# Altium schematic sheet MainBoard_RELAY.SchDoc
size 594 x 420 mm; DocumentNumber: VSL.23-MOTHERBOARD; SheetNumber: 6; Format: A2
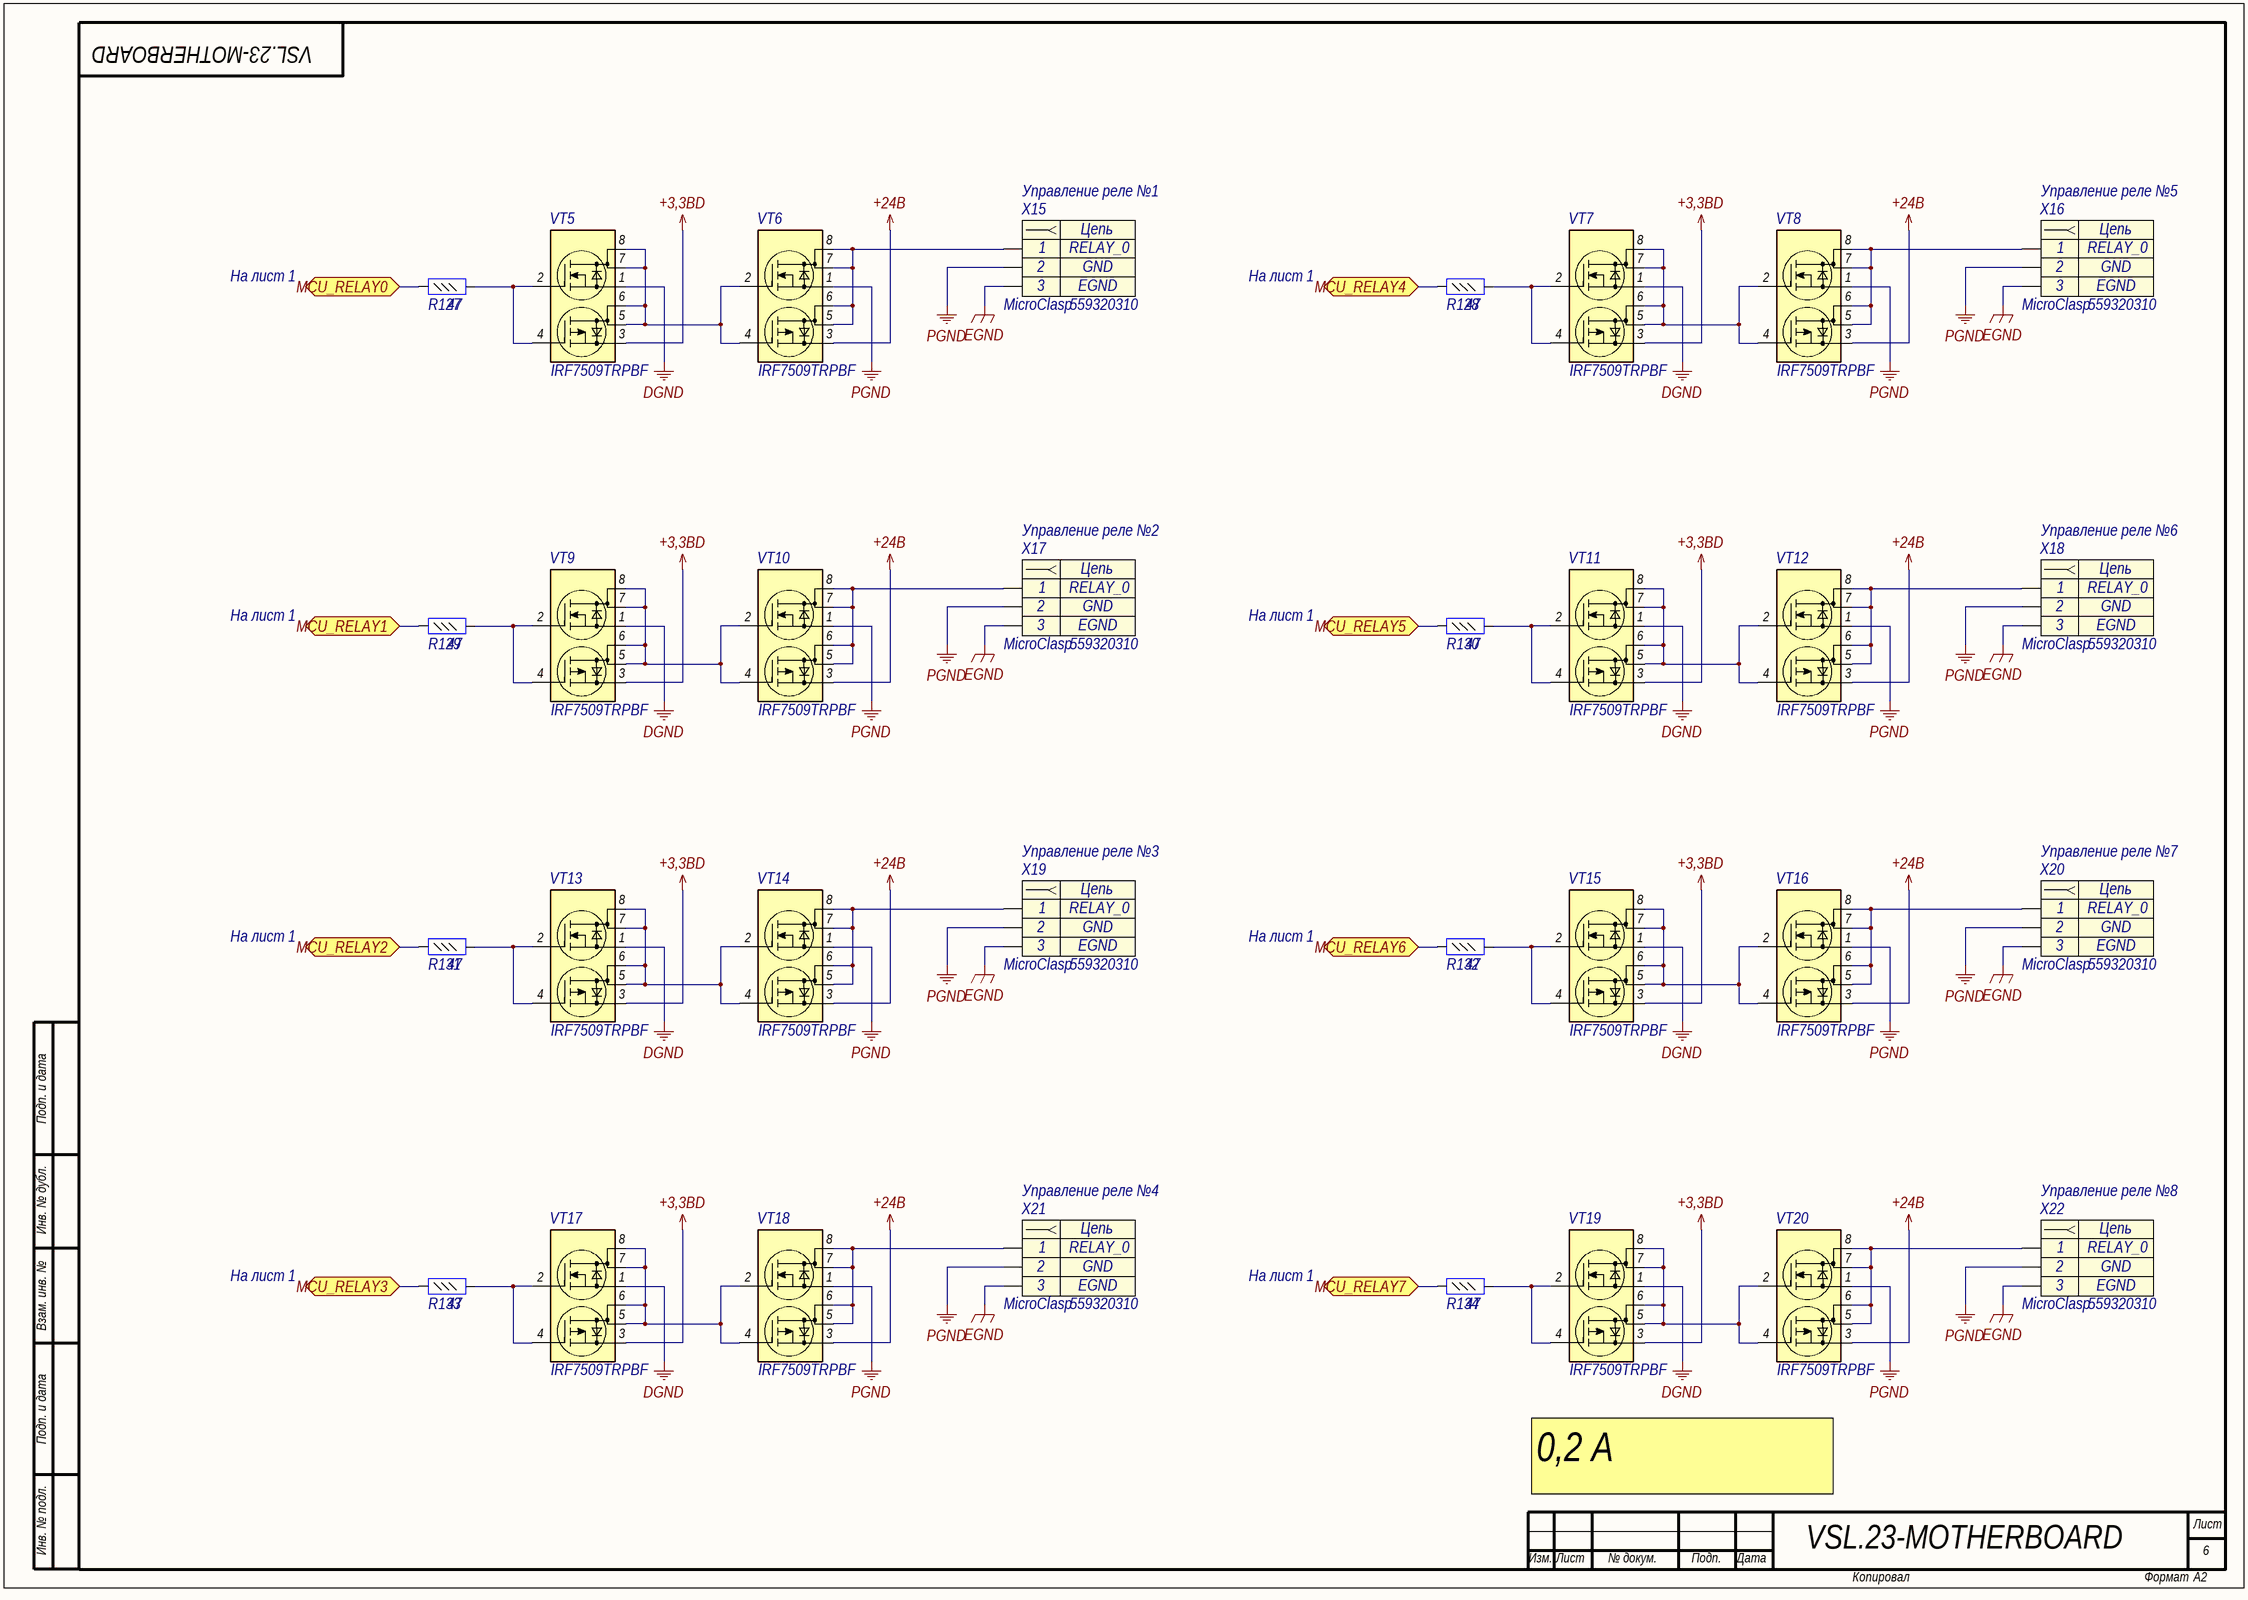
[diagram p0: MainBoard_RELAY.SchDoc]

## Parts
R127  value 47  [R0402]  (hidden comment: Resistor_0,062Вт)
R128  value 47  [R0402]  (hidden comment: Resistor_0,062Вт)
R129  value 47  [R0402]  (hidden comment: Resistor_0,062Вт)
R130  value 47  [R0402]  (hidden comment: Resistor_0,062Вт)
R131  value 47  [R0402]  (hidden comment: Resistor_0,062Вт)
R132  value 47  [R0402]  (hidden comment: Resistor_0,062Вт)
R133  value 47  [R0402]  (hidden comment: Resistor_0,062Вт)
R134  value 47  [R0402]  (hidden comment: Resistor_0,062Вт)
VT5  IRF7509TRPBF  [Micro8]
VT6  IRF7509TRPBF  [Micro8]
VT7  IRF7509TRPBF  [Micro8]
VT8  IRF7509TRPBF  [Micro8]
VT9  IRF7509TRPBF  [Micro8]
VT10  IRF7509TRPBF  [Micro8]
VT11  IRF7509TRPBF  [Micro8]
VT12  IRF7509TRPBF  [Micro8]
VT13  IRF7509TRPBF  [Micro8]
VT14  IRF7509TRPBF  [Micro8]
VT15  IRF7509TRPBF  [Micro8]
VT16  IRF7509TRPBF  [Micro8]
VT17  IRF7509TRPBF  [Micro8]
VT18  IRF7509TRPBF  [Micro8]
VT19  IRF7509TRPBF  [Micro8]
VT20  IRF7509TRPBF  [Micro8]
X15  Управление реле №1  Part Name: MicroClasp  Part Number: 559320310  [MOLEX_559320310]
X16  Управление реле №5  Part Name: MicroClasp  Part Number: 559320310  [MOLEX_559320310]
X17  Управление реле №2  Part Name: MicroClasp  Part Number: 559320310  [MOLEX_559320310]
X18  Управление реле №6  Part Name: MicroClasp  Part Number: 559320310  [MOLEX_559320310]
X19  Управление реле №3  Part Name: MicroClasp  Part Number: 559320310  [MOLEX_559320310]
X20  Управление реле №7  Part Name: MicroClasp  Part Number: 559320310  [MOLEX_559320310]
X21  Управление реле №4  Part Name: MicroClasp  Part Number: 559320310  [MOLEX_559320310]
X22  Управление реле №8  Part Name: MicroClasp  Part Number: 559320310  [MOLEX_559320310]

## Ports
MCU_RELAY0, MCU_RELAY1, MCU_RELAY2, MCU_RELAY3, MCU_RELAY4, MCU_RELAY5, MCU_RELAY6, MCU_RELAY7

## Nets
+3,3BD: VT5.3(S2) VT7.3(S2) VT9.3(S2) VT11.3(S2) VT13.3(S2) VT15.3(S2) VT17.3(S2) VT19.3(S2)
+24B: VT6.3(S2) VT8.3(S2) VT10.3(S2) VT12.3(S2) VT14.3(S2) VT16.3(S2) VT18.3(S2) VT20.3(S2)
DGND: VT5.1(S1) VT7.1(S1) VT9.1(S1) VT11.1(S1) VT13.1(S1) VT15.1(S1) VT17.1(S1) VT19.1(S1)
EGND: X15.3 X16.3 X17.3 X18.3 X19.3 X20.3 X21.3 X22.3
PGND: VT6.1(S1) VT8.1(S1) VT10.1(S1) VT12.1(S1) VT14.1(S1) VT16.1(S1) VT18.1(S1) VT20.1(S1) X15.2 X16.2 X17.2 X18.2 X19.2 X20.2 X21.2 X22.2
MCU_RELAY0: R127.1 ; port MCU_RELAY0
MCU_RELAY1: R129.1 ; port MCU_RELAY1
MCU_RELAY2: R131.1 ; port MCU_RELAY2
MCU_RELAY3: R133.1 ; port MCU_RELAY3
MCU_RELAY4: R128.1 ; port MCU_RELAY4
MCU_RELAY5: R130.1 ; port MCU_RELAY5
MCU_RELAY6: R132.1 ; port MCU_RELAY6
MCU_RELAY7: R134.1 ; port MCU_RELAY7
NetR127_2: R127.2 VT5.2(G1) VT5.4(G2)
NetR128_2: R128.2 VT7.2(G1) VT7.4(G2)
NetR129_2: R129.2 VT9.2(G1) VT9.4(G2)
NetR130_2: R130.2 VT11.2(G1) VT11.4(G2)
NetR131_2: R131.2 VT13.2(G1) VT13.4(G2)
NetR132_2: R132.2 VT15.2(G1) VT15.4(G2)
NetR133_2: R133.2 VT17.2(G1) VT17.4(G2)
NetR134_2: R134.2 VT19.2(G1) VT19.4(G2)
NetVT5_5: VT5.5(D2) VT5.6(D2) VT5.7(D1) VT5.8(D1) VT6.2(G1) VT6.4(G2)
NetVT6_5: VT6.5(D2) VT6.6(D2) VT6.7(D1) VT6.8(D1) X15.1
NetVT7_5: VT7.5(D2) VT7.6(D2) VT7.7(D1) VT7.8(D1) VT8.2(G1) VT8.4(G2)
NetVT8_5: VT8.5(D2) VT8.6(D2) VT8.7(D1) VT8.8(D1) X16.1
NetVT9_5: VT9.5(D2) VT9.6(D2) VT9.7(D1) VT9.8(D1) VT10.2(G1) VT10.4(G2)
NetVT10_5: VT10.5(D2) VT10.6(D2) VT10.7(D1) VT10.8(D1) X17.1
NetVT11_5: VT11.5(D2) VT11.6(D2) VT11.7(D1) VT11.8(D1) VT12.2(G1) VT12.4(G2)
NetVT12_5: VT12.5(D2) VT12.6(D2) VT12.7(D1) VT12.8(D1) X18.1
NetVT13_5: VT13.5(D2) VT13.6(D2) VT13.7(D1) VT13.8(D1) VT14.2(G1) VT14.4(G2)
NetVT14_5: VT14.5(D2) VT14.6(D2) VT14.7(D1) VT14.8(D1) X19.1
NetVT15_5: VT15.5(D2) VT15.6(D2) VT15.7(D1) VT15.8(D1) VT16.2(G1) VT16.4(G2)
NetVT16_5: VT16.5(D2) VT16.6(D2) VT16.7(D1) VT16.8(D1) X20.1
NetVT17_5: VT17.5(D2) VT17.6(D2) VT17.7(D1) VT17.8(D1) VT18.2(G1) VT18.4(G2)
NetVT18_5: VT18.5(D2) VT18.6(D2) VT18.7(D1) VT18.8(D1) X21.1
NetVT19_5: VT19.5(D2) VT19.6(D2) VT19.7(D1) VT19.8(D1) VT20.2(G1) VT20.4(G2)
NetVT20_5: VT20.5(D2) VT20.6(D2) VT20.7(D1) VT20.8(D1) X22.1

## Notes on the sheet
- На лист 1
- Подп. и дата
- Инв. № дубл.
- Взам. инв. №
- 0,2 A
- Инв. № подл.
- Лист
- Изм.
- № докум.
- Подп.
- Дата
- Копировал
- Формат
- (in symbol connect96) Цепь

## Library data of the parts
R127-R134 = res238: Резистор; Manufacture: Yageo; Part Number: RC0402FR-0747RL; id: res238; Accuracy: 0,01; Part Name: Resistor; Power: 0,062Вт
VT5-VT20 = mosfert3: Комплементарная сборка МОП; Manufacturer: International Rectifier; Structure: n-p-channel; V drain-source max: 30B; Rds: 0,11Ohm; Gate-to-source voltage: (+-)20B; Continuous drain current: 2A; Pulsed drain current: 16A; Power dissipation: 1,25W; id: mosfert3; Part Number: IRF7509TRPBF
X15-X22 = connect96: Разъем - 3 конт. розетка; Manufacture: Molex; Contact_1: RELAY_0; Contact_2: GND; Contact_3: EGND; Etch: 2mm; id: connect96